# EAGLE design wifi_temp (EAGLE 7.6.0)
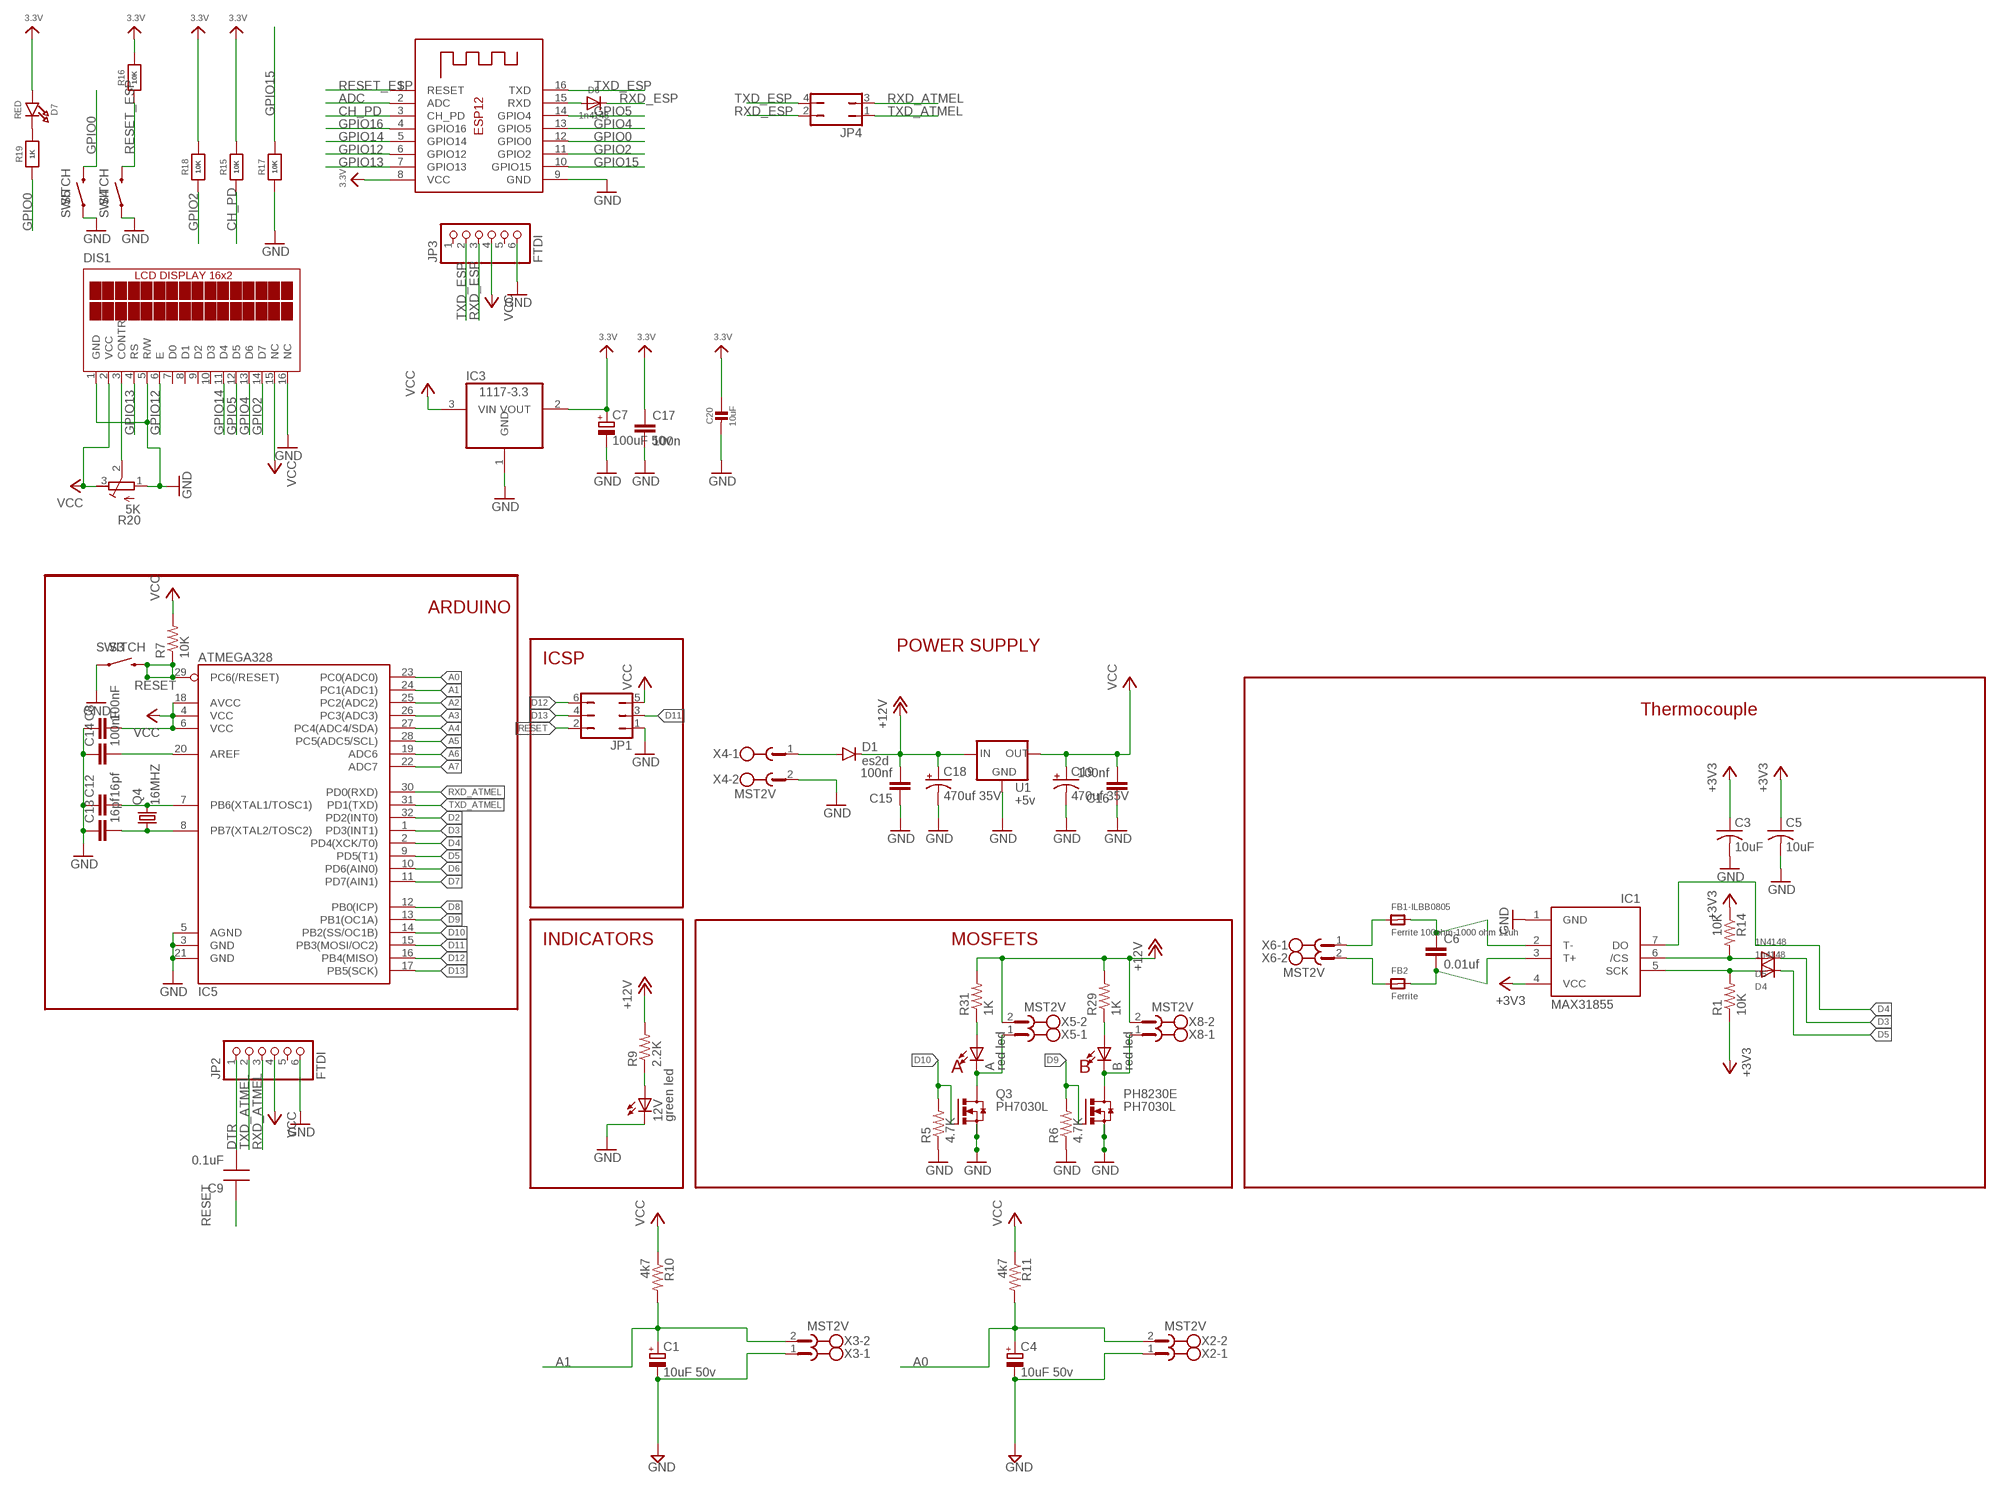
[diagram p0: schematic, sheet 1]

## Parts
12V  green led  LED0805  [LED-0805]
A  red led  LED0805  [LED-0805]
B  red led  LED0805  [LED-0805]
C1  10uF 50v  CPOL-EUSANYO_SMD_B6  [SANYO-OSCON_SMD_B6]
C3  10uF  C-USC0805K  [C0805K]
C4  10uF 50v  CPOL-EUSANYO_SMD_B6  [SANYO-OSCON_SMD_B6]
C5  10uF  C-USC0805K  [C0805K]
C6  0.01uf  CAP0805  [0805]
C7  100uF 50v  CPOL-EUSANYO_SMD_E12  [SANYO-OSCON_SMD_E12]
C8  100nF  CAP0805  [0805]
C9  0.1uF  CAP0805-NP  [CAP0805-NP]
C12  16pf  CAP0805  [0805]
C13  16pf  CAP0805  [0805]
C14  100nF  CAP0805  [0805]
C15  100nf  C-EUC0805  [C0805]
C16  100nf  C-EUC0805  [C0805]
C17  100n  C-EUC0805  [C0805]
C18  470uf 35V  CAP_POLG  [PANASONIC_G]
C19  470uf 35V  CAP_POLG  [PANASONIC_G]
C20  10uF  CAP_CERAMIC0805-NOOUTLINE  [0805-NO]
D1  es2d  DIODESMA-ALT  [SMA-DIODE_ALT]
D4  1n4148  DIODESOD-323F  [SOD-323F]
D5  1N4148  DIODESOD-323F  [SOD-323F]
D6  1n4148  DIODESOD-323  [SOD-323]
D7  RED  LED0805_NOOUTLINE  [CHIPLED_0805_NOOUTLINE]
DIS1  TUXGR_16X2_R2  [TUXGR_16X2_R2]
FB1-ILBB0805  Ferrite 100ohm-1000 ohm 11uh  FERRITE_0805  [_0805]
FB2  Ferrite  FERRITE_0805  [_0805]
IC1  MAX31855  MAX6675  [SO08]
IC3  1117-3.3  REG1117  [SOT223]
IC5  ATMEGA328  ATMEGA168  [TQFP32-08]
JP1  JP3Q  [JP3Q]
JP2  FTDI  HEADER-1X670MIL  [1X06_ROUND_70]
JP3  FTDI  HEADER-1X670MIL  [1X06_ROUND_70]
JP4  JP2Q  [JP2Q]
PH8230E  PH7030L  [SOT669]
Q3  PH7030L  [SOT669]
Q4  16MHZ  CRYSTALSM49  [SM49]
R1  10K  R-US_R0805  [R0805]
R5  4.7K  RESISTOR  [0805]
R6  4.7K  RESISTOR  [0805]
R7  10K  RESISTOR  [0805]
R9  2.2K  RESISTOR  [0805]
R10  4k7  RESISTOR  [0805]
R11  4k7  RESISTOR  [0805]
R14  10K  R-US_R0805  [R0805]
R15  10K  RESISTOR0805_NOOUTLINE  [0805-NO]
R16  10K  RESISTOR0805_NOOUTLINE  [0805-NO]
R17  10K  RESISTOR0805_NOOUTLINE  [0805-NO]
R18  10K  RESISTOR0805_NOOUTLINE  [0805-NO]
R19  1K  RESISTOR0805_NOOUTLINE  [0805-NO]
R20  5K  R-TRIMM3103  [RTRIM3103]
R29  1K  RESISTOR  [0805]
R31  1K  RESISTOR  [0805]
S3  SWITCH  SWITCH-MOMENTARY-2SMD-REDUNDANT  [TACTILE-SWITCH-SMD]
S4  SWITCH  SWITCH-MOMENTARY-2SMD-REDUNDANT  [TACTILE-SWITCH-SMD]
S5  SWITCH  SWITCH-MOMENTARY-2SMD-REDUNDANT  [TACTILE-SWITCH-SMD]
U1  +5v  V_REG_78XX7812  [TO-252]
X2  MST2V  [MSTBV2]
X3  MST2V  [MSTBV2]
X4  MST2V  [MSTBV2]
X5  MST2V  [MSTBV2]
X6  MST2V  [MSTBV2]
X7  ESP-12F  ESP-12  [ESP-12]
X8  MST2V  [MSTBV2]

## Nets
3.3V: C3.1 C5.1 C7.+ C17.1 C20.1 D7.A IC1.4(VCC) IC3.2(VOUT) R1.1 R14.1 R15.2 R16.2 R18.2 X7.8(VCC) ; supply symbol labelled +3V3
+12V [motors]: C15.2 C18.+ D1.C R9.2 R29.2 R31.2 U1.1(IN) X5.2 X8.2
A0: C4.+ IC5.23(PC0(ADC0)) R11.2 X2.2
A1: C1.+ IC5.24(PC1(ADC1)) R10.2 X3.2
A2: IC5.25(PC2(ADC2))
A3: IC5.26(PC3(ADC3))
A4: IC5.27(PC4(ADC4/SDA))
A5: IC5.28(PC5(ADC5/SCL))
A6: IC5.19(ADC6)
A7: IC5.22(ADC7)
ADC: X7.2(ADC)
APWR [motors]: A.C Q3.MB(D) X5.1
BPWR [motors]: B.C PH8230E.MB(D) X8.1
CH_PD: R15.1 X7.3(CH_PD)
CS: D5.A IC1.6(/CS) R14.2
D2: IC5.32(PD2(INT0))
D3: D5.C IC5.1(PD3(INT1))
D4: IC1.7(DO) IC5.2(PD4(XCK/T0))
D5: D4.C IC5.9(PD5(T1))
D6: IC5.10(PD6(AIN0))
D7: IC5.11(PD7(AIN1))
D8: IC5.12(PB0(ICP))
D9: IC5.13(PB1(OC1A)) PH8230E.4(G) R6.2
D10: IC5.14(PB2(SS/OC1B)) Q3.4(G) R5.2
D11: IC5.15(PB3(MOSI/OC2)) JP1.3
D12: IC5.16(PB4(MISO)) JP1.6
D13: IC5.17(PB5(SCK)) JP1.4
DTR: C9.2 JP2.1
GND [motors]: 12V.C C1.- C3.2 C4.- C5.2 C7.- C8.1 C12.1 C13.1 C14.1 C15.1 C16.1 C17.2 C18.- C19.- C20.2 DIS1.1(GND) DIS1.5(R/W) DIS1.16(NC) IC1.1(GND) IC3.1(GND) IC5.3(GND) IC5.5(AGND) IC5.21(GND) JP1.1 JP2.6 JP3.6 PH8230E.1(S) PH8230E.2(S) PH8230E.3(S) Q3.1(S) Q3.2(S) Q3.3(S) R5.1 R6.1 R17.1 R20.1(A) S3.1 S3.2 S4.1 S4.2 S5.1 S5.2 U1.3(GND) X2.1 X3.1 X4.2 X7.9(GND)
GPIO0: R19.1 S5.3 S5.4 X7.12(GPIO0)
GPIO2: DIS1.14(D7) R18.1 X7.11(GPIO2)
GPIO4: DIS1.13(D6) X7.13(GPIO5)
GPIO5: DIS1.12(D5) X7.14(GPIO4)
GPIO12: DIS1.6(E) X7.6(GPIO12)
GPIO13: DIS1.4(RS) X7.7(GPIO13)
GPIO14: DIS1.11(D4) X7.5(GPIO14)
GPIO15: R17.2 X7.10(GPIO15)
GPIO16: X7.4(GPIO16)
N$4: FB1-ILBB0805.1 X6.1
N$5: C6.2 FB2.2 IC1.3(T+)
N$6: D1.A X4.1
N$7: DIS1.3(CONTR) R20.2(S)
N$8: C6.1 FB1-ILBB0805.2 IC1.2(T-)
N$9: FB2.1 X6.2
N$11: D7.C R19.2
N$12: D6.A X7.15(RXD)
N$20: C14.2 IC5.20(AREF)
N$26: 12V.A R9.1
N$31: C12.2 IC5.7(PB6(XTAL1/TOSC1)) Q4.2
N$32: C13.2 IC5.8(PB7(XTAL2/TOSC2)) Q4.1
N$41: A.A R31.1
N$42: B.A R29.1
RESET: C9.1 IC5.29(PC6(/RESET)) JP1.2 R7.1 S3.3 S3.4
RESET_ESP: R16.1 S4.3 S4.4 X7.1(RESET)
RXD_ATMEL: IC5.30(PD0(RXD)) JP2.3 JP4.3
RXD_ESP: D6.C JP3.3 JP4.2
SCK: D4.A IC1.5(SCK) R1.2
TXD_ATMEL: IC5.31(PD1(TXD)) JP2.2 JP4.1
TXD_ESP: JP3.2 JP4.4 X7.16(TXD)
VCC: C8.2 C16.2 C19.+ DIS1.2(VCC) DIS1.15(NC) IC3.3(VIN) IC5.4(VCC) IC5.6(VCC) IC5.18(AVCC) JP1.5 JP2.4 JP3.4 R7.2 R10.1 R11.1 R20.3(E) U1.2(OUT)
Unconnected: DIS1.7(D0) DIS1.8(D1) DIS1.9(D2) DIS1.10(D3) JP2.5 JP3.1 JP3.5

## Notes on the sheet
- ARDUINO
- POWER SUPPLY
- ICSP
- Thermocouple
- INDICATORS | MOSFETS
- A | B

## Library data of the parts
12V A B = SparkFun:LED: LEDs Standard schematic elements and footprints for 5mm, 3mm, 1206, and 0603 sized LEDs. 5mm - Spark Fun Electronics SKU : COM-00529 (and others)
C1 C4 C7 = rcl:CPOL-EU: POLARIZED CAPACITOR, European symbol
C3 C5 = adafruit:C-US: CAPACITOR, American symbol
C6 = SparkFun-Capacitors:CAP: Capacitor Standard 0603 ceramic capacitor, and 0.1" leaded capacitor.
C8 C12-C14 = SparkFun:CAP: Capacitor Standard 0603 ceramic capacitor, and 0.1" leaded capacitor.
C9 = MySMD:CAP0805-NP
C15 C16 = resistor:C-EU: CAPACITOR, European symbol
C17 = rcl:C-EU: CAPACITOR, European symbol
C18 C19 = SparkFun-Capacitors:CAP_POL: Capacitor Polarized These are standard SMD and PTH capacitors. Normally 10uF, 47uF, and 100uF in electrolytic and tantalum varieties. Always verify the external diameter of the through hole cap, it varies with capacity, voltage, and manufacturer. The EIA devices should be standard.
C20 = microbuilder:CAP_CERAMIC: Ceramic Capacitors For new designs, use the packages preceded by an '_' character since they are more reliable: The following footprints should be used on most boards: _0402 - Standard footprint for regular board layouts _0603 - Standard footprint for regular board layouts _0805 - Standard footprint for regular board layouts _1206 - Standard footprint for regular board layouts For extremely tight-pitch boards where space is at a premium, the following 'micro-pitch' footprints can be used (smaller pads, no silkscreen outline, etc.): _0402MP - Micro-pitch footprint for very dense/compact boards _0603MP - Micro-pitch footprint for very dense/compact boards _0805MP - Micro-pitch footprint for very dense/compact boards _1206MP - Micro-pitch footprint for very dense/compact boards
D1 = SparkFun-DiscreteSemi:DIODE: Diode
D4 D5 = adafruit:DIODE: Diode
D6 = microbuilder:DIODE: Diode
D7 = microbuilder:LED: LED 0603 - 0603 Surface Mount Package 2mA: Green LED - Low Power (3.9mcd, 2ma, 1.7Vf) - Digikey: 475-2709-2-ND Orange LED - Low Power (9.8mcd, 2ma, 1.8Vf) - Digikey: 475-1194-2-ND Red LED - Low Power (5mcd, 2ma, 1.8Vf) - Digikey: 475-1195-2-ND Yellow LED - Low Power (7mcd, 2ma, 1.8Vf) - Digikey: 475-1196-2-ND 5mA: Blue LED - Low Power (17mcd, 5ma, 2.9Vf) - Digikey: LNJ937W8CRACT-ND 0805 - 0805 Surface Mount Package 2mA: Red LED (8.8mcd, 2mA, 1.8Vf, Clear) - Low Power [Digikey: 475-2510-1-ND] Green LED (5mcd, 2mA, 1.8Vf, Clear) - Low Power [Digikey: 475-2730-1-ND] Yellow LED (11.3mcd, 2mA, 1.8Vf, Clear) - Low Power [Digikey: 475-2555-1-ND] 20mA: Red LED (104mcd, 20mA, Diffused) - LS R976 [Digikey: 475-1278-6-ND] Red LED (12mcd, 20mA, 2.0Vf, Clear) - APT2012EC [Digikey: 754-1128-1-ND] Green LED (15mcd, 20mA, 2.2Vf, Clear) - APT2012GC [Digikey: 754-1131-1-ND] Orange LED (160mcd, 20mA, 2.1Vf, Clear) - APT2012SECK [Digikey: 754-1130-1-ND] 1206 - 1206 Surface Mount Package Green LED (26mcd, 20mA, Diffused) - LG N971 [Digikey: 475-1407-6-ND] Red LED (15mcd, 20mA, Diffused) - LH N974 [Digikey: 475-1416-6-ND] Cree - Cree High-Power Surface Mount LEDs XPEBWT-L1-0000-00D50 - White 111lm 350mA 2.9Vf 6200K 110° XTEAWT-00-0000-00000LEE3 - White 114lm 350mA 2.85Vf 5000K 115° Everlight - Everlight 45-21 Series Surface Mount LEDs 45-21/QK2C-B2832AC2CB2/2T - Warm White 2000mcd 20mA 3.25Vf 3050K 120° 45-21/LK2C-B38452C4CB2/2T - Nuetral White 2000mcd 20mA 3.25Vf 4150K 120° 45-21/LK2C-B50634C6CB2/2T - Cold White 2200mcd 20mA 3.25Vf 5650K 120° PLCC2 Reverse Mount LS T77K-J1L2-1-0-2-R18-Z - Red 11.25mcd 2mA 1.8Vf 630nm 120° LO T77K-L1M2-24-Z - Orange 19.6mcd 2mA 1.8Vf 606nm 120° LY T77K-K2M1-26-Z - Yellow 15.7mcd 2mA 1.8Vf 587nm 120°
DIS1 = display-lcd:TUXGR_16X2_R2: Tuxgraphics LCD display 16x2 characters reflective, without background light Source: tuxgr_12x2_r2.pdf
FB1-ILBB0805 FB2 = microbuilder:FERRITE: Ferrite Bead 0603 MMZ1608B121C - 120 Ohm @ 100MHz, 600mA, 0.15 Ohm DC Resistance - Digikey: 445-2164-1-ND BK1608HW121-T - 120 Ohm, 600mA Ferrite Chip - Digikey: 587-1876-2-ND 0805 HZ0805B272R-10 - 2.7K Ohm @ 100MHz, 200mA, 0.8 Ohm DC Resistance - Digikey: 240-2504-1-ND (see also Murata BLM21BD272SN1L) MMZ2012Y152B - 1.5K Ohm @ 100MHz, 500mA, 0.4 Ohm DC Resistance - Digikey: 445-1560-1-ND - Mainly for high frequency (80-400MHz) MMZ2012R102A - 1K Ohm @ 100MHz, 500mA, 0.3 Ohm DC Resistance - Digikey: 445-1555-2-ND - More general purpose (10-200MHz)
IC1 = adafruit:MAX6675
IC3 = burr-brown:REG1117: 800mA and 1A Low Dropout (LDO) Positive Regulator 1.8V, 2.5V, 2.85V, 3.3V, 5V, and Adj; MPN: REG1117; OC_FARNELL: 1097566; OC_NEWARK: 14P6981
IC5 = SparkFun:ATMEGA168
JP1 = jumper:JP3Q: JUMPER
JP2 JP3 = microbuilder:HEADER-1X6: PIN HEADER
JP4 = jumper:JP2Q: JUMPER
PH8230E Q3 = transistor-power:PH7030L: N-channel TrenchMOS (TM) logic level FET Source: http://www.nxp.com/acrobat_download/datasheets/PH7030L_4.pdf
Q4 = crystal:CRYSTAL: CRYSTAL
R1 R14 = adafruit:R-US_: RESISTOR, American symbol
R5-R7 R9-R11 R29 R31 = SparkFun:RESISTOR: Resistor Basic schematic elements and footprints for 0603, 1206, and PTH 1/10th watt (small) resistors.
R15-R19 = microbuilder:RESISTOR: Resistors For new designs, use the packages preceded by an '_' character since they are more reliable: The following footprints should be used on most boards: _0402 - Standard footprint for regular board layouts _0603 - Standard footprint for regular board layouts _0805 - Standard footprint for regular board layouts _1206 - Standard footprint for regular board layouts For extremely tight-pitch boards where space is at a premium, the following 'micro-pitch' footprints can be used (smaller pads, no silkscreen outline, etc.): _0402MP - Micro-pitch footprint for very dense/compact boards _0603MP - Micro-pitch footprint for very dense/compact boards _0805MP - Micro-pitch footprint for very dense/compact boards _1206MP - Micro-pitch footprint for very dense/compact boards
R20 = resistor:R-TRIMM: Trimm resistor
S3-S5 = SparkFun-Electromechanical:SWITCH-MOMENTARY-2: Various NO switches- pushbuttons, reed, etc; PROD_ID: SWCH-08247
U1 = SparkFun-PowerIC:V_REG_78XX: Voltage Regulator Standard 78xx regulator. IGO (Input Ground Output). Spark Fun Electronics SKU : COM-00107; PROD_ID: VREG-12370; VALUE: +12v
X2-X6 X8 = con-phoenix-508:MST2V: PHOENIX
X7 = microbuilder:ESP-12

## Net classes
0 default: width 0.254 mm, clearance 0.254 mm
1 vcc: width 0.305 mm
2 motors: width 1.016 mm

## Board
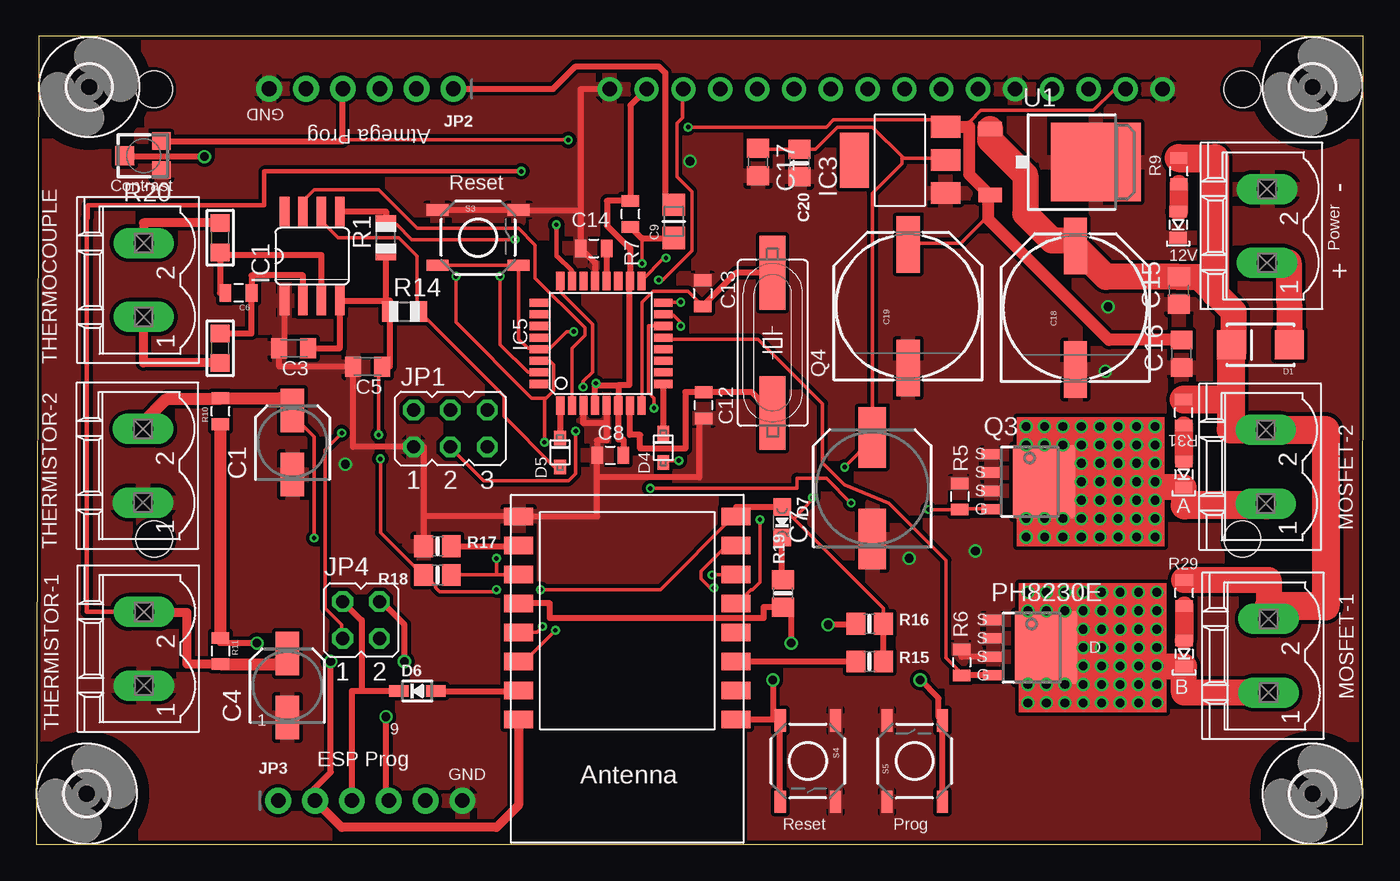
[diagram p1: board, top side]
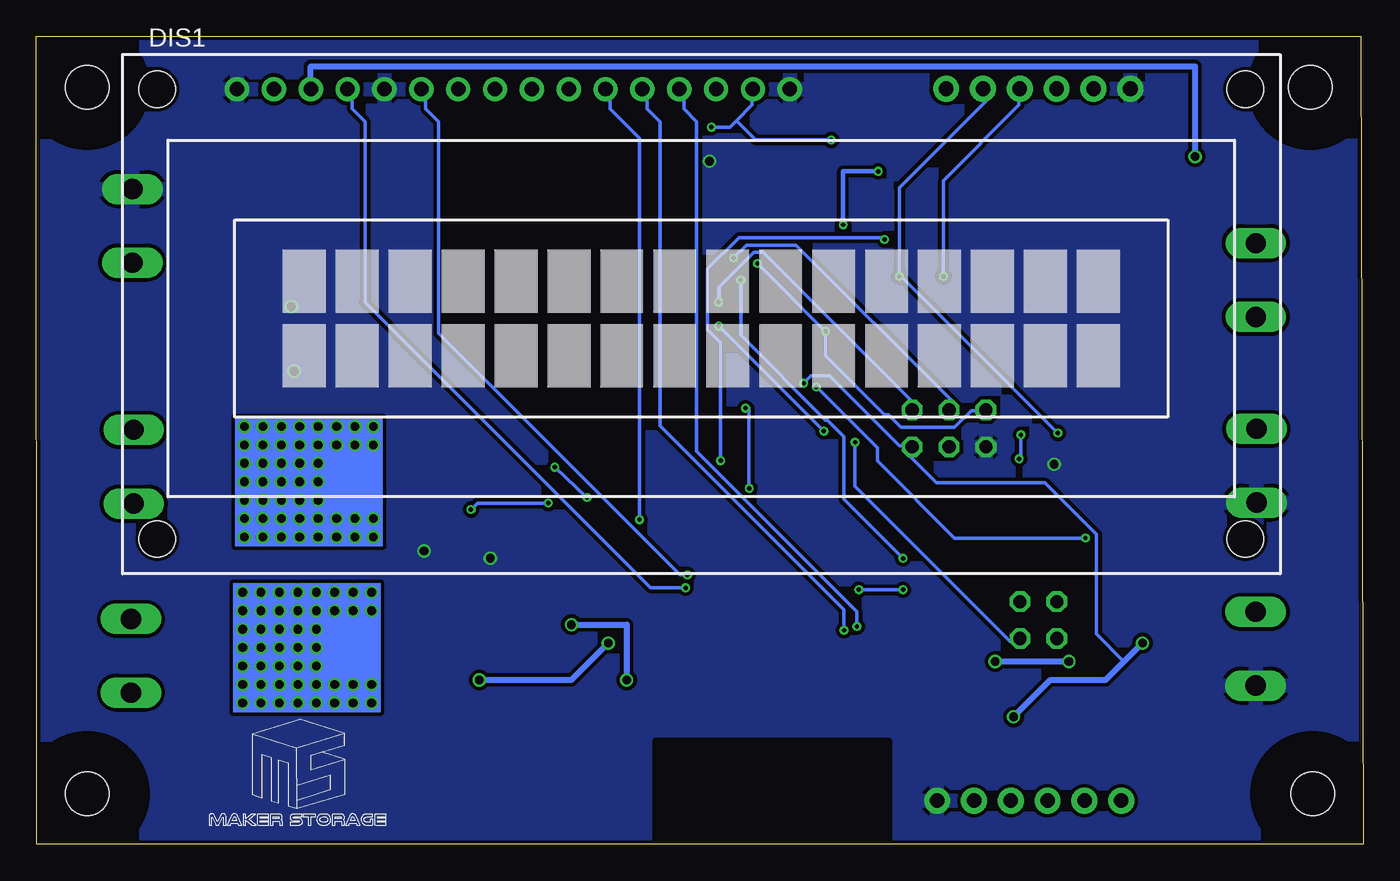
[diagram p2: board, bottom side, seen from below]

Size 91.47 x 55.68 mm. Coordinates in mm from the lower left corner, seen from the top.
Outline: 0,0 91.44,0 91.47,55.68 0.16,55.68 0,0
Copper layers (1*16): Top 0.035mm / dielectric 1.5mm / Bottom 0.035mm
Design rules "default": minimum track width 6mil, minimum drill 12mil, track to track 6mil, track to pad 6mil, pad to pad 6mil, via to via 6mil, smd to smd 0mil, copper to edge 10mil, drill to drill 10mil, minimum pad ring 10mil, minimum via ring 6mil, stop-mask expansion 2mil, vias tented up to drill 100mil, thermal gap 10mil

### Footprints (pad centres in the part's own frame; a part is rotated, then mirrored left to right if it is on the bottom)
LED-0805 = smd 1.2 x 0.8: A 0,-0.9; C 0,0.9
SANYO-OSCON_SMD_B6 = smd 3 x 1.6: + 2.2,0; - -2.2,0
C0805K = smd 1.1 x 1.4: 1 -1,0; 2 1,0
0805 = smd 0.8 x 1.2: 1 -0.9,0; 2 0.9,0
SANYO-OSCON_SMD_E12 = smd 4.15 x 1.9: + 3.5,0; - -3.5,0
CAP0805-NP = smd 1.524 x 1.524: 1 0,0; 2 2.286,0
C0805 = smd 1.3 x 1.5: 1 -0.95,0; 2 0.95,0
PANASONIC_G = smd 3.9 x 1.6: + 4.25,0; - -4.25,0
0805-NO = smd 1.3 x 1.5: 1 -0.95,0; 2 0.95,0
SMA-DIODE_ALT = smd 2 x 2: A -2,0; C 2,0
SOD-323F = smd 1 x 0.8: A -1,0; C 1,0
SOD-323 = smd 1.35 x 0.8: A 1.27,0; C -1.27,0
CHIPLED_0805_NOOUTLINE = smd 1.2 x 1.2: A 0,-1.05; C 0,1.05
TUXGR_16X2_R2 = drill 1 pad 1.676: 1 -32,15.5; 2 -29.46,15.5; 3 -26.92,15.5; 4 -24.38,15.5; 5 -21.84,15.5; 6 -19.3,15.5; 7 -16.76,15.5; 8 -14.22,15.5; 9 -11.68,15.5; 10 -9.14,15.5; 11 -6.6,15.5; 12 -4.06,15.5; 13 -1.52,15.5; 14 1.02,15.5; 15 3.56,15.5; 16 6.1,15.5 | hole 2.5: -37.5,-15.5; 37.5,-15.5; -37.5,15.5; 37.5,15.5
_0805 = smd 1.2 x 1.3: 1 -1.016,0; 2 1.016,0
SO08 = smd 0.66 x 2.032: 1 -1.905,-3.073; 2 -0.635,-3.073; 3 0.635,-3.073; 4 1.905,-3.073; 5 1.905,3.073; 6 0.635,3.073; 7 -0.635,3.073; 8 -1.905,3.073
SOT223 = smd 1.499 x 2.007: 1 -2.261,-3.15; 2 0.025,-3.15; 3 2.311,-3.15 | smd 3.81 x 2.007: 4 0,3.15
TQFP32-08 = smd 1.27 x 0.559: 1 -4.293,2.8; 2 -4.293,2; 3 -4.293,1.2; 4 -4.293,0.4; 5 -4.293,-0.4; 6 -4.293,-1.2; 7 -4.293,-2; 8 -4.293,-2.8; 17 4.293,-2.8; 18 4.293,-2; 19 4.293,-1.2; 20 4.293,-0.4; 21 4.293,0.4; 22 4.293,1.2; 23 4.293,2; 24 4.293,2.8 | smd 0.559 x 1.27: 9 -2.8,-4.293; 10 -2,-4.293; 11 -1.2,-4.293; 12 -0.4,-4.293; 13 0.4,-4.293; 14 1.2,-4.293; 15 2,-4.293; 16 2.8,-4.293; 25 2.8,4.293; 26 2,4.293; 27 1.2,4.293; 28 0.4,4.293; 29 -0.4,4.293; 30 -1.2,4.293; 31 -2,4.293; 32 -2.8,4.293
JP3Q = drill 0.914 octagon: 1 -2.54,-1.27; 2 -2.54,1.27; 3 0,-1.27; 4 0,1.27; 5 2.54,-1.27; 6 2.54,1.27
1X06_ROUND_70 = drill 1 pad 1.778: 1 -6.35,0; 2 -3.81,0; 3 -1.27,0; 4 1.27,0; 5 3.81,0; 6 6.35,0
JP2Q = drill 0.914 octagon: 1 -1.27,-1.27; 2 -1.27,1.27; 3 1.27,-1.27; 4 1.27,1.27
SOT669 = smd 0.7 x 1.4: 1 -1.905,-2.65; 2 -0.635,-2.65; 3 0.635,-2.65; 4 1.905,-2.65 | smd 5 x 4.3: MB 0,1
SM49 = smd 5.08 x 1.778: 1 -4.826,0; 2 4.826,0
R0805 = smd 1.1 x 1.4: 1 -1,0; 2 1,0
RTRIM3103 = smd 1.2 x 1.25: 1 -1,-1.225; 3 1,-1.225 | smd 1.3 x 1.3: 2 0,1.3
TACTILE-SWITCH-SMD = smd 1.524 x 0.762: 1 -2.794,1.905; 2 2.794,1.905; 3 -2.794,-1.905; 4 2.794,-1.905
TO-252 = smd 1 x 1.6: 1 -2.28,-4.8; 2 2.28,-4.8 | smd 5.4 x 6.2: 3 0,2.5
3,0 = hole 3: 0,0
MSTBV2 = drill 1.397 long: 1 -2.54,0; 2 2.54,0
ESP-12 = smd 2 x 1.2: 1 -7.5,4.5; 2 -7.5,2.5; 3 -7.5,0.5; 4 -7.5,-1.5; 5 -7.5,-3.5; 6 -7.5,-5.5; 7 -7.5,-7.5; 8 -7.5,-9.5; 9 7.5,-9.5; 10 7.5,-7.5; 11 7.5,-5.5; 12 7.5,-3.5; 13 7.5,-1.5; 14 7.5,0.5; 15 7.5,2.5; 16 7.5,4.5

### Placement (x,y rotation side)
12V  78.72,42.69 180 top
A  79.1,25.49 180 top
B  79.12,13.14 180 top
C1  17.66,27.68 90 top
C3  17.76,34.18 180 top
C4  17.31,10.93 90 top
C5  22.84,32.91 180 top
C6  13.95,37.99 180 top
C7  57.63,24.53 90 top
C8  39.57,26.81 0 top
C9  43.94,41.77 90 top
C12  46,30.25 90 top
C13  45.93,37.97 270 top
C14  38.43,41.06 0 top
C15  78.75,38.15 90 top
C16  78.94,33.8 90 top
C17  49.76,47.01 270 top
C18  71.63,36.97 90 top
C19  60.1,37.07 90 top
C20  52.62,46.94 270 top
D1  84.39,34.41 180 top
D4  43.22,27.32 90 top
D5  36.11,27 90 top
D6  26.26,10.56 0 top
D7  51.41,22.18 180 top
DIS1  45.63,36.53 0 bottom
FB1-ILBB0805  12.68,34.18 90 top
FB2  12.68,41.8 270 top
IC1  19.03,40.53 0 top
IC3  59.54,47.13 90 top
IC5  38.92,34.51 90 top
JP1  28.55,28.65 0 top
JP2  22.4,52.06 180 top
JP3  23.03,3 0 top
JP4  22.39,15.45 0 top
PH8230E  68.61,13.55 270 top
Q3  68.49,24.98 270 top
Q4  50.76,34.55 270 top
R1  24.11,41.8 90 top
R5  63.66,23.96 270 top
R6  63.79,12.53 270 top
R7  40.96,43.43 90 top
R9  78.76,46.38 90 top
R10  12.7,29.84 90 top
R11  12.71,13.31 270 top
R14  25.38,36.72 0 top
R15  57.44,12.59 0 top
R16  57.44,15.19 0 top
R17  27.66,20.53 0 top
R18  27.66,18.56 180 top
R19  51.47,17.29 90 top
R20  7.41,47.45 90 top
R29  79.13,17.32 90 top
R31  79.09,29.75 90 top
S3  30.46,41.8 0 top
S4  53.19,5.73 270 top
S5  60.55,5.73 90 top
U1  70.55,47.01 270 top
U$1  [3,0]  3.48,3.48 0 top
U$2  [3,0]  87.98,52.18 0 top
U$3  [3,0]  3.65,52.18 0 top
U$4  [3,0]  87.98,3.48 0 top
X2  7.41,13.48 90 top
X3  7.36,26.09 90 top
X4  84.85,42.61 90 top
X5  84.76,26.02 90 top
X6  7.41,38.88 90 top
X7  40.74,13.1 180 top
X8  84.95,12.99 90 top

### Tracks (layer width: path | path; a pad name or v marks a point on that pad's centre or on a via)
3.3V  (via drill 0.3)
  Top 0.254: v23.72,26.56 23.72,21.48 26.65,18.56 R18.2 26.77,18.56 27.53,17.8 27.53,17.67 27.79,17.41 31.6,17.41 v31.73,17.54 | v23.6,28.21 23.6,32.65 23.72,32.78 C5.1 | 52.24,22.43 51.54,23.13 D7.A | 52.24,22.43 58.4,16.27 58.4,15.38 R16.2 | C17.1 49.76,47.89 52.55,47.89 C20.1 52.68,47.89 53.7,47.89 55.22,49.42 57.63,49.42 59.73,47.32 | 59.73,47.32 59.79,47.26 62.59,47.26 IC3.2 | 59.73,47.32 59.67,47.26 59.67,46.88 57.63,44.85 C7.+ 57.63,27.96 v55.73,25.99 | 52.24,22.43 53.51,23.76 v53.51,23.89 | v34.77,17.54 43.03,17.54 48.11,22.62 X7.8
  Top 0.406: C3.1 20.93,34.18 IC1.4 24.38,37.46 R14.1 | C5.1 24.38,32.91 R14.1 | R14.1 24.11,36.72 R1.1 | R15.2 R16.2 | D7.A 48.24,23.23 X7.8
  Bottom 0.254: v23.72,26.56 23.6,26.69 v23.6,28.21 | v55.73,25.99 v53.51,23.89 | v34.77,17.54 v31.73,17.54
+12V
  Top 1.778: R29.2 84.95,18.22 84.95,16.4 X8.2 | D1.C 82.53,33.97 82.53,36.72 81.26,37.99 80.14,39.1 C15.2 73.75,39.1 C18.+ 71.24,41.61 70.02,41.61 68.17,43.45 68.17,46.12 65.75,48.54 U1.1
  Top 1.93: 84.95,16.4 88.88,16.4 88.88,28.56 X5.2 84.76,28.59 82.34,28.59 82.34,30.65 | R9.2 81.26,47.28 81.26,37.99 | D1.C 82.34,34.41 82.34,30.65 | R31.2 82.34,30.65
A0  (via drill 0.3)
  Top 0.305: IC5.23 36.92,39.52 35.92,40.53 35.85,40.53 v35.85,42.69 | v33.44,46.37 15.72,46.37 15.72,44.02 3.53,44.02 3.53,43.13 3.47,43.13 3.47,16.02 X2.2
  Top 0.61: R11.2 10.39,12.41 10.39,15.95 7.41,15.95 X2.2
  Top 0.813: R11.2 16.59,12.41 C4.+
  Bottom 0.305: v35.85,42.69 35.85,46.37 v33.44,46.37
A1  (via drill 0.3)
  Top 0.254: v37.69,31.51 37.69,31.89 38.33,32.53 38.33,35.83 36.17,37.99 36.17,38.75 IC5.24 | v19.15,21.1 19.15,28.08 17.76,29.48 C1.+
  Top 0.813: X3.2 7.3,28.99 8.99,30.69 12.64,30.69 R10.2 16.8,30.74 C1.+
  Bottom 0.254: v37.69,31.51 33.5,27.32 33.5,26.43 28.17,21.1 v19.15,21.1
APWR
  Top 1.778: 79.17,23.35 A.C 69.49,24.59 Q3.MB
  Top 1.93: X5.1 84.82,23.35 79.17,23.35
BPWR
  Top 1.778: X8.1 79.12,10.45 B.C 69.61,12.24 PH8230E.MB
CH_PD
  Top 0.406: X7.3 R15.1
CS
  Top 0.254: D5.A 36.04,26.05 35.66,26.05 32.23,29.48 32.23,30.88 26.39,36.72 R14.2 26.26,36.72 26.26,40.53 24.99,41.8 20.8,41.8 19.66,42.94 IC1.6
D3
  Top 0.406: IC5.1 36.12,28.02 D5.C
D4
  Top 0.254: IC1.7 18.39,44.34 19.15,45.1 23.6,45.1 26.26,42.43 33.25,42.43 34.39,41.29 34.39,39 37.82,35.58 37.82,35.07 36.93,34.18 36.93,30.24 IC5.2
D5
  Top 0.406: IC5.9 D4.C
D9
  Top 0.254: IC5.13 43.28,34.81 49.76,34.81 54.2,30.37 54.2,26.3 55.73,24.78 58.78,23.51 62.71,19.57 62.71,12.84 63.73,11.83 R6.2
  Top 0.406: PH8230E.4 63.79,11.64 R6.2
D10  (via drill 0.3)
  Top 0.254: Q3.4 65.76,23.13 63.73,23.13 R5.2 v61.51,23.07 | IC5.14 42.2,35.71 42.2,31.13 42.58,30.75 v42.58,30.05 | v42.33,24.53 52.43,24.53 52.43,25.22 54.46,25.22 v56.17,23.51
  Bottom 0.254: v42.58,30.05 42.33,30.05 v42.33,24.53 | v56.17,23.51 61.06,23.51 v61.51,23.07
D11  (via drill 0.3)
  Top 0.254: v44.43,35.7 44.43,35.96 43.92,36.46 43.28,36.46 IC5.15 | v37.19,28.46 37.19,25.54 36.68,25.03 30.84,25.03 28.55,27.32 JP1.3
  Bottom 0.254: v37.19,28.46 v44.43,35.7
D12  (via drill 0.3)
  Top 0.254: v44.43,37.35 43.28,37.35 IC5.16
  Bottom 0.254: v44.43,37.35 44.43,38.37 42.01,40.78 41.38,40.78 31.09,30.5 JP1.6
D13  (via drill 0.3)
  Top 0.254: v43.41,40.4 43.28,40.4 41.76,38.88 IC5.17
  Bottom 0.254: v43.41,40.4 42.52,41.29 39.09,41.29 28.42,30.62 28.42,30.11 28.55,29.99 JP1.4
DTR
  Top 0.406: JP2.1 35.64,52.06 37.19,53.61 42.9,53.61 43.35,53.17 43.35,44.66 C9.2
GND  (via drill 0.6)
  Top 0.406: IC5.5 39.32,29.04 | 39.32,29.04 39.32,27.85 39.35,27.83 38.65,27.83 38.65,26.83 C8.1 38.67,25.33 | IC5.3 37.69,30.22 37.69,29.04 39.32,29.04 | IC5.21 38.52,40.07 C14.1 37.53,43.7 | C12.1 45.7,29.04 45.7,25.29 38.71,25.29 38.67,25.33 | S3.1 S3.2 37.53,43.7 | DIS1.16 37.53,52.03 37.53,43.7 | PH8230E.3 63.79,12.91 R6.1 | IC1.1 17.12,34.18 C3.2 16.76,32.91 C5.2 21.84,27.38 JP1.1 26.71,27.38 26.71,22.6 | 26.71,22.6 X7.9 38.67,22.6 38.67,25.33 | 26.71,22.6 R17.1
  other vias: 60.17,19.7 21.31,26.18 45.06,47.07 73.7,32.59 73.89,37.04 64.75,20.21
  pour Top (isolate 0.254): -0.6,86.12 112.37,78.72 112.23,-6.37 -1.12,-7.07
  pour Bottom (isolate 0.254): -2.96,74.99 110.31,75.48 109.8,-4.16 -1.15,-4.31
GPIO0  (via drill 0.6)
  Top 0.406: S5.3 S5.4 62.21,8.78 62.21,10.05 v60.94,11.32 | v52.05,13.86 52.05,16.4 R19.1 50.14,16.34 50.14,15.57 35.41,15.57 35.41,16.59 X7.12
  Bottom 0.406: v52.05,13.86 54.59,11.32 v60.94,11.32
GPIO2  (via drill 0.3)
  Top 0.254: 31.73,18.56 33.12,18.56 X7.11 | 31.73,18.56 R18.1 | v42.9,38.88 43.16,38.88 45.19,40.91 45.19,44.97 44.17,45.99 44.17,49.67 44.55,50.05 44.55,51.96 DIS1.14 | 31.73,18.56 v31.73,19.7
  Bottom 0.254: v42.9,38.88 42.9,35.07 37.06,29.23 36.93,29.23 35.79,28.08 35.79,23.76 v31.73,19.7
GPIO4  (via drill 0.3)
  Top 0.254: v34.9,15 34.52,14.62 33.25,14.62 X7.13
  Bottom 0.254: v34.9,15 34.9,16.02 45.95,27.07 45.95,49.8 46.84,50.69 46.84,51.2 47.09,51.45 47.09,51.96 DIS1.13
GPIO5  (via drill 0.3)
  Top 0.254: v35.79,14.75 33.76,12.72 33.25,12.72 X7.14
  Bottom 0.254: v35.79,14.75 35.79,16.14 48.49,28.84 48.49,49.8 49.38,50.69 49.38,51.2 49.63,51.45 49.63,51.96 DIS1.12
GPIO12  (via drill 0.3)
  Top 0.254: v46.58,18.56 48.24,18.56 X7.6
  Bottom 0.254: v46.58,18.56 47.09,18.56 63.73,35.19 63.73,49.8 64.62,50.69 64.62,51.2 64.87,51.45 64.87,51.96 DIS1.6
GPIO13  (via drill 0.3)
  Top 0.254: v46.71,17.67 46.46,17.67 45.82,18.3 45.82,18.81 47.6,20.59 X7.7
  Bottom 0.254: v46.71,17.67 49.12,17.67 68.81,37.35 68.81,49.8 69.7,50.69 69.7,51.2 69.95,51.45 69.95,51.96 DIS1.4
GPIO14  (via drill 0.3)
  Top 0.254: v49.89,22.37 49.89,18.05 49.38,17.54 49.25,17.54 48.36,16.65 X7.5
  Bottom 0.254: v49.89,22.37 49.89,48.66 51.92,50.69 51.92,51.2 52.17,51.45 52.17,51.96 DIS1.11
GPIO15
  Top 0.406: R17.2 33.24,20.53 X7.10
N$4
  Top 0.61: FB1-ILBB0805.1 7.41,33.16 X6.1
N$5
  Top 0.406: C6.2 12.68,37.99 FB2.2 12.68,40.59 19.66,40.59 IC1.3
N$6
  Top 1.778: X4.1 86.33,40.07 D1.A
N$7  (via drill 0.6)
  Top 0.406: v11.6,47.39 6.1,47.39 R20.2
  Bottom 0.406: DIS1.3 72.56,53.61 11.6,53.61 v11.6,47.39
N$8
  Top 0.406: FB1-ILBB0805.2 14.85,35.19 C6.1 14.85,39.19 18.39,39.19 IC1.2
N$9
  Top 0.61: FB2.1 7.41,42.81 X6.2
N$10  (via drill 0.6 pad 0)
  other vias: 68.23,28.79
N$11
  Top 0.406: R19.2 51.41,18.24 D7.C
N$12
  Top 0.406: D6.A 33.2,10.56 X7.15
N$13  (via drill 0.6 pad 0)
  other vias: 69.5,28.79
N$14  (via drill 0.6 pad 0)
  other vias: 70.77,28.79
N$15  (via drill 0.6 pad 0)
  other vias: 72.04,28.79
N$16  (via drill 0.6 pad 0)
  other vias: 73.31,28.79
N$17  (via drill 0.6 pad 0)
  other vias: 74.58,28.79
N$19  (via drill 0.6 pad 0)
  other vias: 75.85,28.79
N$20
  Top 0.406: C14.2 39.32,41.05 IC5.20
N$21  (via drill 0.6 pad 0)
  other vias: 77.12,28.79
N$22  (via drill 0.6 pad 0)
  other vias: 77.12,27.52
N$24  (via drill 0.6 pad 0)
  other vias: 75.85,27.52
N$26
  Top 1.27: 12V.A 78.76,43.59 R9.1
N$27  (via drill 0.6 pad 0)
  other vias: 74.58,27.52
N$28  (via drill 0.6 pad 0)
  other vias: 73.31,27.52
N$31
  Top 0.406: IC5.7 40.92,28.21 41.63,28.21 41.63,27.26 44.74,27.26 44.74,31.15 C12.2 49.33,31.15 Q4.2
N$32
  Top 0.254: IC5.8 41.76,30.24 41.76,37.35 42.52,38.12 44.93,38.12 45.82,37.23 C13.2
  Top 0.406: Q4.1 48.24,39.37 C13.2
N$33  (via drill 0.6 pad 0)
  other vias: 72.04,27.52
N$34  (via drill 0.6 pad 0)
  other vias: 70.77,27.52
N$35  (via drill 0.6 pad 0)
  other vias: 69.5,27.52
N$41
  Top 1.27: R31.1 79.09,26.4 A.A
N$42
  Top 1.27: R29.1 B.A
N$43  (via drill 0.6 pad 0)
  other vias: 68.23,27.52
N$54  (via drill 0.6 pad 0)
  other vias: 72.04,26.25
N$55  (via drill 0.6 pad 0)
  other vias: 73.31,26.25
N$56  (via drill 0.6 pad 0)
  other vias: 74.58,26.25
N$57  (via drill 0.6 pad 0)
  other vias: 75.85,26.25
N$58  (via drill 0.6 pad 0)
  other vias: 77.12,26.25
N$62  (via drill 0.6 pad 0)
  other vias: 72.04,24.98
N$63  (via drill 0.6 pad 0)
  other vias: 73.31,24.98
N$64  (via drill 0.6 pad 0)
  other vias: 74.58,24.98
N$65  (via drill 0.6 pad 0)
  other vias: 75.85,24.98
N$66  (via drill 0.6 pad 0)
  other vias: 77.12,24.98
N$70  (via drill 0.6 pad 0)
  other vias: 72.04,23.71
N$71  (via drill 0.6 pad 0)
  other vias: 73.31,23.71
N$72  (via drill 0.6 pad 0)
  other vias: 74.58,23.71
N$73  (via drill 0.6 pad 0)
  other vias: 75.85,23.71
N$74  (via drill 0.6 pad 0)
  other vias: 77.12,23.71
N$75  (via drill 0.6 pad 0)
  other vias: 77.12,22.44
N$76  (via drill 0.6 pad 0)
  other vias: 75.85,22.44
N$77  (via drill 0.6 pad 0)
  other vias: 74.58,22.44
N$78  (via drill 0.6 pad 0)
  other vias: 73.31,22.44
N$79  (via drill 0.6 pad 0)
  other vias: 72.04,22.44
N$80  (via drill 0.6 pad 0)
  other vias: 70.77,22.44
N$81  (via drill 0.6 pad 0)
  other vias: 69.5,22.44
N$82  (via drill 0.6 pad 0)
  other vias: 68.23,22.44
N$84  (via drill 0.6 pad 0)
  Top 0.61: v68.23,21.17 v69.5,21.17
N$85  (via drill 0.6 pad 0)
  other vias: 70.77,21.17
N$86  (via drill 0.6 pad 0)
  other vias: 72.04,21.17
N$87  (via drill 0.6 pad 0)
  other vias: 73.31,21.17
N$88  (via drill 0.6 pad 0)
  other vias: 74.58,21.17
N$89  (via drill 0.6 pad 0)
  other vias: 75.85,21.17
N$90  (via drill 0.6 pad 0)
  other vias: 77.12,21.17
N$91  (via drill 0.6 pad 0)
  other vias: 68.36,17.36
N$92  (via drill 0.6 pad 0)
  other vias: 69.63,17.36
N$93  (via drill 0.6 pad 0)
  other vias: 70.9,17.36
N$94  (via drill 0.6 pad 0)
  other vias: 72.17,17.36
N$95  (via drill 0.6 pad 0)
  other vias: 73.44,17.36
N$96  (via drill 0.6 pad 0)
  other vias: 74.71,17.36
N$97  (via drill 0.6 pad 0)
  other vias: 75.98,17.36
N$98  (via drill 0.6 pad 0)
  other vias: 77.25,17.36
N$99  (via drill 0.6 pad 0)
  other vias: 77.25,16.09
N$100  (via drill 0.6 pad 0)
  other vias: 75.98,16.09
N$101  (via drill 0.6 pad 0)
  other vias: 74.71,16.09
N$102  (via drill 0.6 pad 0)
  other vias: 73.44,16.09
N$103  (via drill 0.6 pad 0)
  other vias: 72.17,16.09
N$104  (via drill 0.6 pad 0)
  other vias: 70.9,16.09
N$105  (via drill 0.6 pad 0)
  other vias: 69.63,16.09
N$106  (via drill 0.6 pad 0)
  other vias: 68.36,16.09
N$110  (via drill 0.6 pad 0)
  other vias: 72.17,14.82
N$111  (via drill 0.6 pad 0)
  other vias: 73.44,14.82
N$112  (via drill 0.6 pad 0)
  other vias: 74.71,14.82
N$113  (via drill 0.6 pad 0)
  other vias: 75.98,14.82
N$114  (via drill 0.6 pad 0)
  other vias: 77.25,14.82
N$115  (via drill 0.6 pad 0)
  other vias: 77.25,13.55
N$116  (via drill 0.6 pad 0)
  other vias: 75.98,13.55
N$117  (via drill 0.6 pad 0)
  other vias: 74.71,13.55
N$118  (via drill 0.6 pad 0)
  other vias: 73.44,13.55
N$119  (via drill 0.6 pad 0)
  other vias: 72.17,13.55
N$126  (via drill 0.6 pad 0)
  other vias: 72.17,12.28
N$127  (via drill 0.6 pad 0)
  other vias: 73.44,12.28
N$128  (via drill 0.6 pad 0)
  other vias: 74.71,12.28
N$129  (via drill 0.6 pad 0)
  other vias: 75.98,12.28
N$130  (via drill 0.6 pad 0)
  other vias: 77.25,12.28
N$131  (via drill 0.6 pad 0)
  other vias: 68.36,11.01
N$132  (via drill 0.6 pad 0)
  other vias: 69.63,11.01
N$133  (via drill 0.6 pad 0)
  other vias: 70.9,11.01
N$134  (via drill 0.6 pad 0)
  other vias: 72.17,11.01
N$135  (via drill 0.6 pad 0)
  other vias: 73.44,11.01
N$136  (via drill 0.6 pad 0)
  other vias: 74.71,11.01
N$137  (via drill 0.6 pad 0)
  other vias: 75.98,11.01
N$138  (via drill 0.6 pad 0)
  other vias: 77.25,11.01
N$139  (via drill 0.6 pad 0)
  other vias: 77.25,9.74
N$140  (via drill 0.6 pad 0)
  other vias: 75.98,9.74
N$141  (via drill 0.6 pad 0)
  other vias: 74.71,9.74
N$142  (via drill 0.6 pad 0)
  other vias: 73.44,9.74
N$143  (via drill 0.6 pad 0)
  other vias: 72.17,9.74
N$144  (via drill 0.6 pad 0)
  other vias: 70.9,9.74
N$145  (via drill 0.6 pad 0)
  other vias: 69.63,9.74
N$146  (via drill 0.6 pad 0)
  other vias: 68.36,9.74
RESET  (via drill 0.3)
  Top 0.254: S3.3 S3.4 33.25,34.81 33.88,34.18 34.52,34.18 IC5.29 34.65,34.18 35.41,34.18 36.55,35.32 v37.06,35.32 | v41.76,40.02 41.76,41.77
  Top 0.406: R7.1 41.71,41.77 41.76,41.77 C9.1
  Bottom 0.254: v41.76,40.02 v37.06,35.32 37.06,33.67 33,29.61 32.74,29.61 31.85,28.72 28.17,28.72 27.03,29.86 26.01,29.86 JP1.2
RESET_ESP  (via drill 0.6)
  Top 0.406: S4.4 S4.3 51.28,8.6 50.78,8.6 | X7.1 50.78,8.6 | v50.78,11.32 50.78,8.6 | v54.59,15.13 55.86,15.13 R16.1
  Bottom 0.406: v50.78,11.32 50.78,15.13 v54.59,15.13
RXD_ATMEL  (via drill 0.3)
  Top 0.254: 35.09,30.69 35.03,30.62 v35.03,27.7 | 35.09,30.69 35.66,31.26 35.66,33.04 35.41,33.29 34.65,33.29 IC5.30 | v28.93,39.13 28.93,35.96 34.14,30.75 35.03,30.75 35.09,30.69
  Bottom 0.254: v35.03,27.7 35.03,24.65 24.36,13.99 23.85,13.99 JP4.3 | v28.93,39.13 28.93,45.74 23.72,50.94 23.72,51.96 JP2.3
RXD_ESP
  Top 0.406: JP3.3 21.76,10.56 D6.C 22.45,10.56 22.45,15.45 22.39,15.45 JP4.2
SCK  (via drill 0.3)
  Top 0.254: v44.3,26.43 43.28,26.43 D4.A | v33,41.67 25.88,41.67 24.87,42.69 24.23,42.69 R1.2
  Top 0.406: IC1.5 24.11,43.6 R1.2
  Bottom 0.254: v44.3,26.43 44.3,34.56 45.19,35.45 45.19,39.64 43.03,41.8 33.12,41.8 v33,41.67
TXD_ATMEL  (via drill 0.3)
  Top 0.254: v31.98,39.13 31.98,34.43 33.88,32.53 34.52,32.53 IC5.31 | v21.06,28.34 19.91,27.19 19.91,16.27 21.06,15.13 21.06,14.24 JP4.1
  Bottom 0.254: 31.98,39.26 31.98,45.23 26.01,51.2 26.01,51.83 26.14,51.96 JP2.2 | 31.98,39.26 v21.06,28.34 | 31.98,39.26 v31.98,39.13
TXD_ESP  (via drill 0.6)
  Top 0.406: v25.38,12.59 25.38,15.13 24.11,16.4 JP4.4 | v20.3,12.59 20.3,4.97 19.03,3.7 JP3.2
  Top 0.61: X7.16 33.24,2.68 31.73,1.16 21.06,1.16 JP3.2
  Bottom 0.406: v20.3,12.59 v25.38,12.59
VCC  (via drill 0.3, 0.6)
  Top 0.254: v38.58,31.77 38.58,31.64 | DIS1.2 75.03,51.96 74.27,51.96 72.87,50.56 65.13,50.56 64.36,49.8 64.3,49.44 | C19.+ 60.17,41.42 63.73,41.42 65.25,42.94 65.63,43.07 | v44.93,49.42 54.46,49.42 54.97,49.93 61.95,49.93 62.33,49.55 IC3.3 | v36.68,48.53 21.31,48.53 21.13,48.45
  Top 0.406: C8.2 40.47,27.89 40.11,27.89 40.11,30.22 IC5.6 40.12,31.64 | IC5.4 38.52,31.64 38.58,31.64 40.12,31.64 | DIS1.15 40.96,50.91 R7.2 40.94,44.34 39.35,44.34 39.35,42.62 40.93,41.04 IC5.18 40.87,38.8 40.87,31.64 40.12,31.64 | v15.22,13.86 12.68,13.86 R11.1 | v24.11,8.78 24.11,3.7 JP3.4 | R20.3 21.13,48.45 JP2.4
  Top 0.813: C16.2 73.96,34.75 65.63,43.07 65.63,44.61 U1.2 64.3,46.17 64.3,49.44 IC3.3 | R11.1 R10.1
  Bottom 0.254: 31.22,27.45 31.98,27.45 36.81,32.27 38.08,32.27 v38.58,31.77 | 31.22,27.45 31.09,27.45 JP1.5 31.22,27.45 | 43.22,49.86 43.66,49.42 v44.93,49.42 | 43.22,49.86 42.14,50.94 42.14,51.96 DIS1.15 | v36.68,48.53 41.89,48.53 43.22,49.86 | 16.49,12.59 18.39,14.49 18.39,21.35 21.95,24.91 29.44,24.91 31.22,26.69 31.22,27.45
  Bottom 0.406: v15.22,13.86 16.49,12.59 17.76,11.32 21.57,11.32 v24.11,8.78
(copper drawn outside any net)
  shapes: Bottom area x2, Top area x2

### Text on the board
Bottom: D
tPlace: GND | Atmega Prog | Contrast | Reset | - | Power | + | THERMOCOUPLE | S | S | S | G | MOSFET-2 | THERMISTOR-2 | S | S | D | S | G | MOSFET-1 | THERMISTOR-1 | 1 | 9 | ESP Prog | GND | Reset | Prog